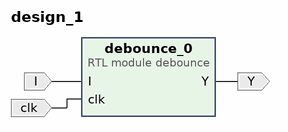
[diagram p0: block diagram of the top level]
# Vivado block design design_1, xc7z007sclg400-1, Vivado 2024.1.1
create_bd_design design_1

create_bd_port -dir I I
create_bd_port -dir I clk
create_bd_port -dir O Y

create_bd_cell -type module -reference debounce debounce_0

# ---- connections ----

connect_bd_net [get_bd_ports I] [get_bd_pins debounce_0/I]
connect_bd_net [get_bd_ports clk] [get_bd_pins debounce_0/clk]
connect_bd_net [get_bd_pins debounce_0/Y] [get_bd_ports Y]

validate_bd_design
save_bd_design
